# Altium schematic sheet [08] - Microcontroller.SchDoc
size A3
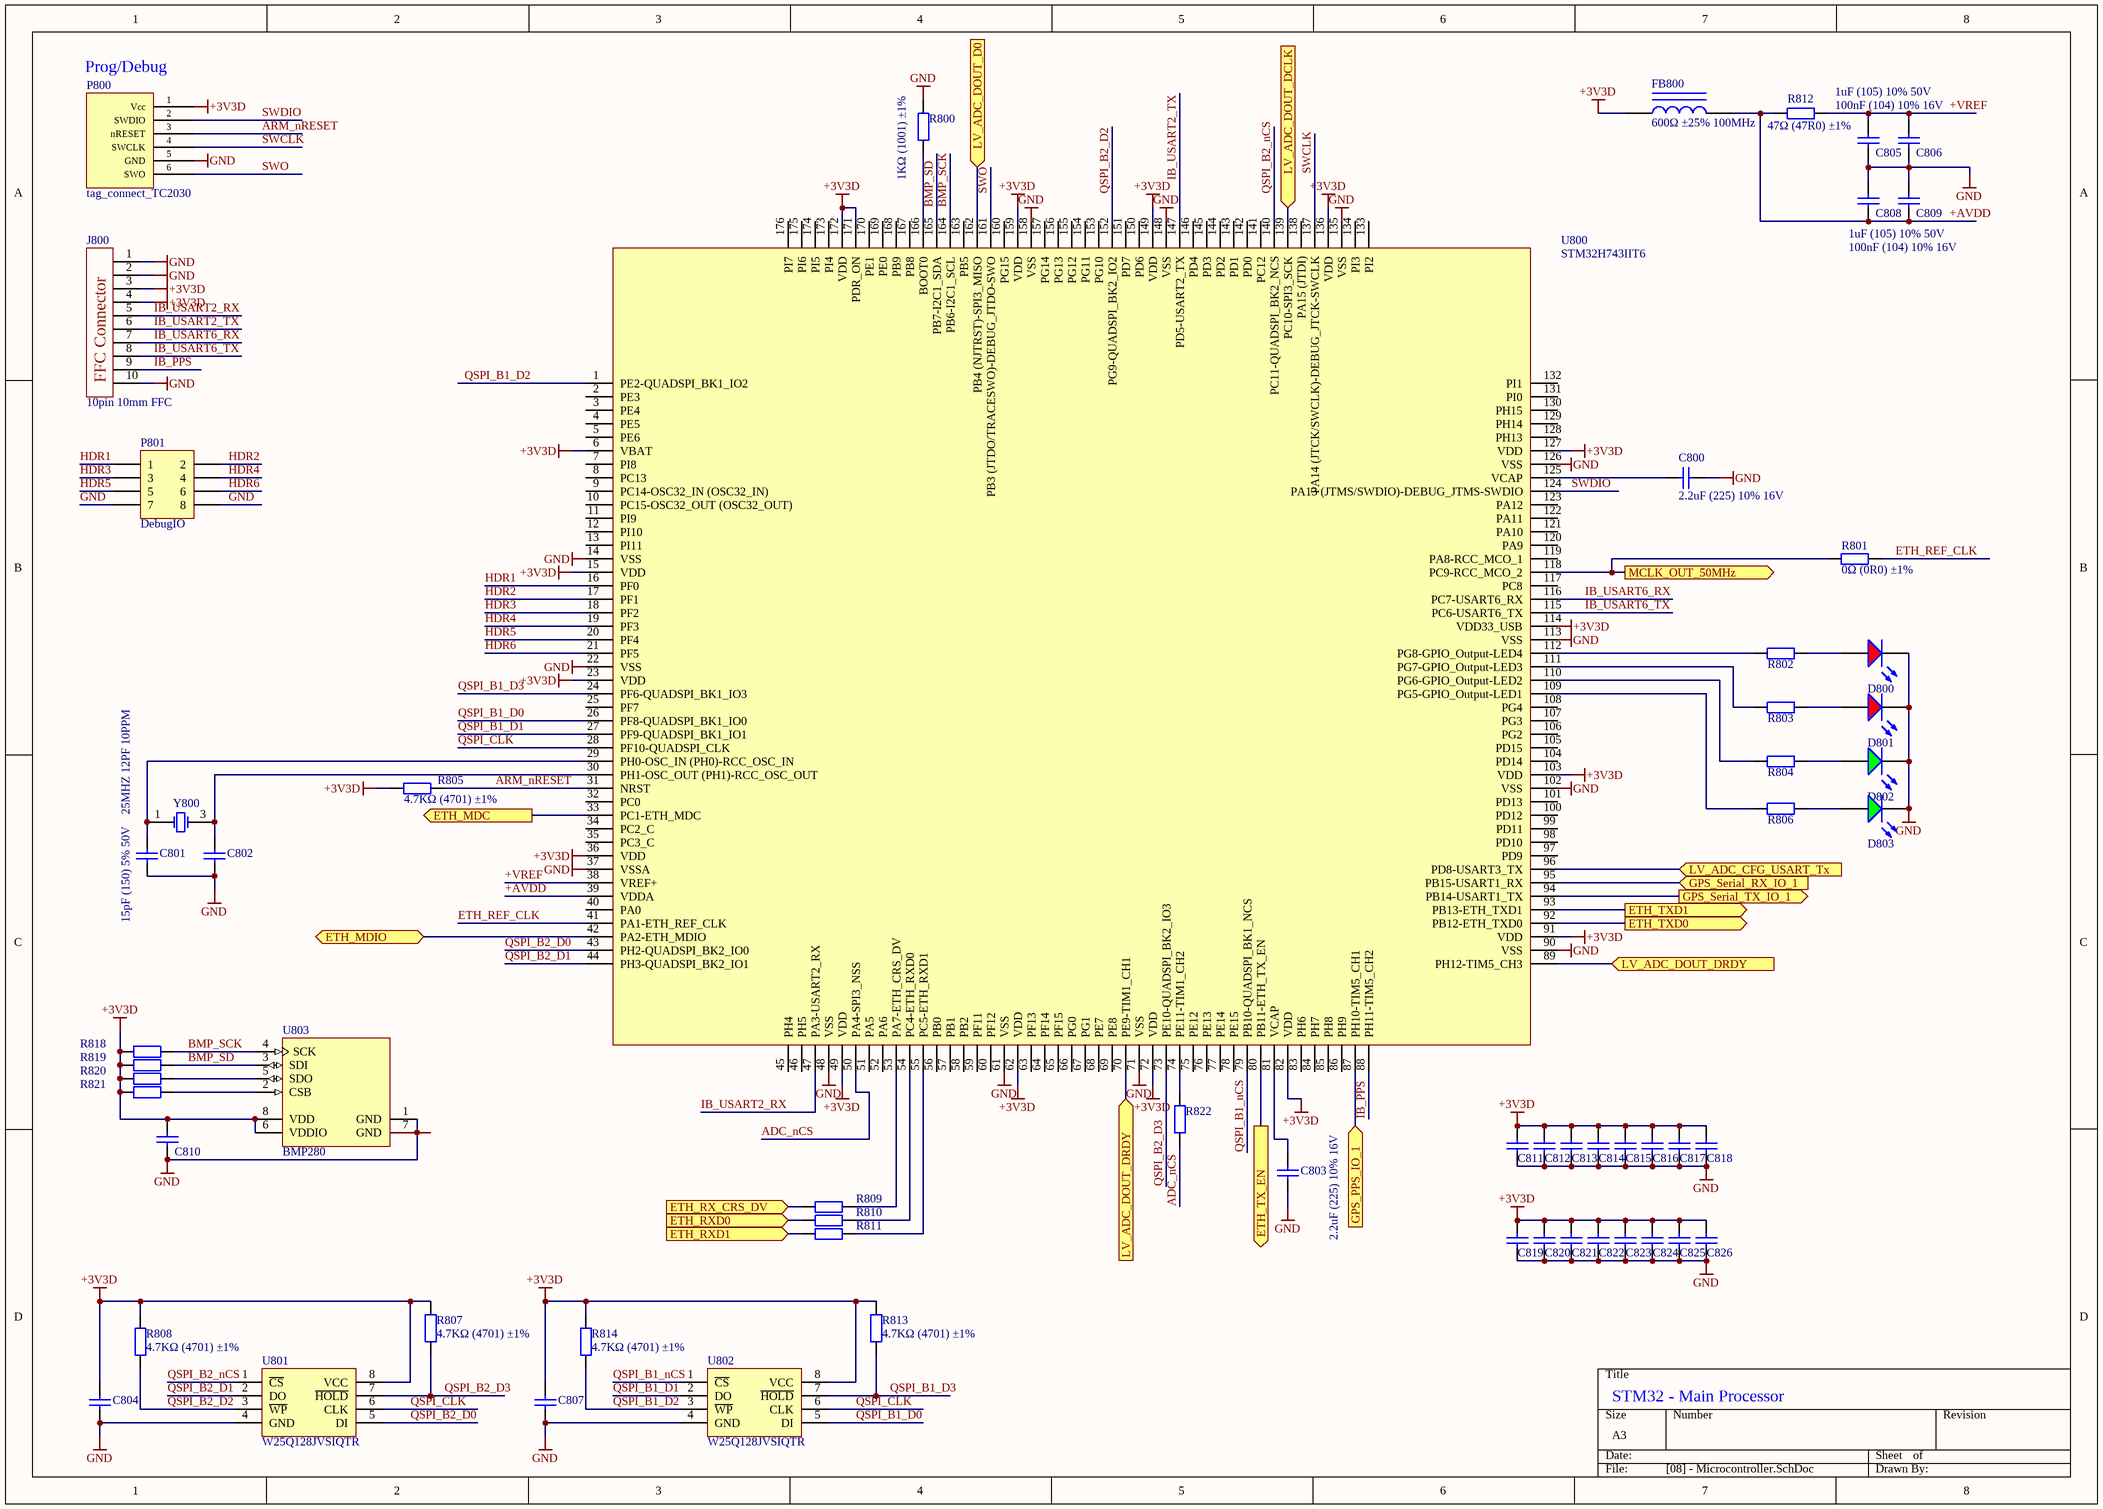
[diagram p0: [08] - Microcontroller.SchDoc]

## Parts
C800  2.2uF (225) 10% 16V  [0603_C]
C801  15pF (150) 5% 50V  [0402_C]
C802  15pF (150) 5% 50V  [0402_C]  (value not drawn)
C803  2.2uF (225) 10% 16V  [0603_C]
C804  100nF (104) 10% 16V  [0402_C]  (value not drawn)
C805  1uF (105) 10% 50V  [0603_C]
C806  100nF (104) 10% 16V  [0402_C]
C807  100nF (104) 10% 16V  [0402_C]  (value not drawn)
C808  1uF (105) 10% 50V  [0603_C]
C809  100nF (104) 10% 16V  [0402_C]
C810  100nF (104) 10% 16V  [0402_C]  (value not drawn)
C811  100nF (104) 10% 16V  [0402_C]  (value not drawn)
C812  100nF (104) 10% 16V  [0402_C]  (value not drawn)
C813  100nF (104) 10% 16V  [0402_C]  (value not drawn)
C814  100nF (104) 10% 16V  [0402_C]  (value not drawn)
C815  100nF (104) 10% 16V  [0402_C]  (value not drawn)
C816  100nF (104) 10% 16V  [0402_C]  (value not drawn)
C817  100nF (104) 10% 16V  [0402_C]  (value not drawn)
C818  100nF (104) 10% 16V  [0402_C]  (value not drawn)
C819  100nF (104) 10% 16V  [0402_C]  (value not drawn)
C820  100nF (104) 10% 16V  [0402_C]  (value not drawn)
C821  100nF (104) 10% 16V  [0402_C]  (value not drawn)
C822  100nF (104) 10% 16V  [0402_C]  (value not drawn)
C823  100nF (104) 10% 16V  [0402_C]  (value not drawn)
C824  100nF (104) 10% 16V  [0402_C]  (value not drawn)
C825  100nF (104) 10% 16V  [0402_C]  (value not drawn)
C826  100nF (104) 10% 16V  [0402_C]  (value not drawn)
D800  红灯 0603  [0603_LED_S1]  (value not drawn)
D801  红灯 0603  [0603_LED_S1]  (value not drawn)
D802  绿灯 0603  [0603_LED_S1]  (value not drawn)
D803  绿灯 0603  [0603_LED_S1]  (value not drawn)
FB800  600Ω ±25% 100MHz  [0805_L]
J800  10pin 10mm FFC  [AFA07-S10FCC-00]
P800  tag_connect_TC2030  [TC2030-MCP-NL]
P801  DebugIO  [HDR2X4]
R800  1KΩ (1001) ±1%  [0402_R]
R801  0Ω (0R0) ±1%  [0402_R]
R802  150Ω (1500) ±1%  [0402_R]  (value not drawn)
R803  150Ω (1500) ±1%  [0402_R]  (value not drawn)
R804  150Ω (1500) ±1%  [0402_R]  (value not drawn)
R805  4.7KΩ (4701) ±1%  [0402_R]
R806  150Ω (1500) ±1%  [0402_R]  (value not drawn)
R807  4.7KΩ (4701) ±1%  [0402_R]
R808  4.7KΩ (4701) ±1%  [0402_R]
R809  49.9Ω (49R9) ±1%  [0402_R]  (value not drawn)
R810  49.9Ω (49R9) ±1%  [0402_R]  (value not drawn)
R811  49.9Ω (49R9) ±1%  [0402_R]  (value not drawn)
R812  47Ω (47R0) ±1%  [0402_R]
R813  4.7KΩ (4701) ±1%  [0402_R]
R814  4.7KΩ (4701) ±1%  [0402_R]
R818  4.7KΩ (4701) ±1%  [0402_R]  (value not drawn)
R819  4.7KΩ (4701) ±1%  [0402_R]  (value not drawn)
R820  4.7KΩ (4701) ±1%  [0402_R]  (value not drawn)
R821  4.7KΩ (4701) ±1%  [0402_R]  (value not drawn)
R822  0Ω (0R0) ±1%  [0402_R]  (value not drawn)
U800  STM32H743IIT6  [Quad176]
U801  W25Q128JVSIQTR  [SOIC-8_208mil]
U802  W25Q128JVSIQTR  [SOIC-8_208mil]
U803  BMP280  [BOSC-LGA-8_V_LARGE]
Y800  25MHZ 12PF 10PPM  [SMD-3225_4P]

## Ports
ETH_MDC (out), ETH_MDIO (bidir), ETH_RX_CRS_DV (in), ETH_RXD0 (in), ETH_RXD1 (in), ETH_TX_EN (out), ETH_TXD0 (out), ETH_TXD1 (out), GPS_PPS_IO_1 (in), GPS_Serial_RX_IO_1 (in), GPS_Serial_TX_IO_1 (out), LV_ADC_CFG_USART_Tx (in), LV_ADC_DOUT_D0 (in), LV_ADC_DOUT_DCLK (in), LV_ADC_DOUT_DRDY (in), MCLK_OUT_50MHz (out)

## Nets
+3V3D: C804.2 C807.2 C810.2 C811.2 C812.2 C813.2 C814.2 C815.2 C816.2 C817.2 C818.2 C819.2 C820.2 C821.2 C822.2 C823.2 C824.2 C825.2 C826.2 FB800.1 J800.3 J800.4 P800.1(Vcc) R805.2 R807.2 R808.1 R813.2 R814.1 R818.1 R819.1 R820.1 R821.1 U800.6(VBAT) U800.15(VDD) U800.23(VDD) U800.36(VDD) U800.49(VDD) U800.62(VDD) U800.72(VDD) U800.82(VDD) U800.91(VDD) U800.103(VDD) U800.114(VDD33_USB) U800.127(VDD) U800.136(VDD) U800.149(VDD) U800.159(VDD) U800.171(PDR_ON) U800.172(VDD) U801.8(VCC) U802.8(VCC) U803.6(VDDIO) U803.8(VDD)
GND: C800.2 C801.1 C802.1 C803.2 C804.1 C805.1 C806.1 C807.1 C808.2 C809.2 C810.1 C811.1 C812.1 C813.1 C814.1 C815.1 C816.1 C817.1 C818.1 C819.1 C820.1 C821.1 C822.1 C823.1 C824.1 C825.1 C826.1 D800.K D801.K D802.K D803.K J800.1 J800.2 J800.10 P800.5(GND) P801.7 P801.8 R800.2 U800.14(VSS) U800.22(VSS) U800.37(VSSA) U800.48(VSS) U800.61(VSS) U800.71(VSS) U800.90(VSS) U800.102(VSS) U800.113(VSS) U800.126(VSS) U800.135(VSS) U800.148(VSS) U800.158(VSS) U801.4(GND) U802.4(GND) U803.1(GND) U803.7(GND)
+AVDD: C808.1 C809.1 FB800.2 R812.1 U800.39(VDDA)
+VREF: C805.2 C806.2 R812.2 U800.38(VREF+)
ADC_nCS: R822.1 U800.50(PA4-SPI3_NSS)
ARM_nRESET: P800.3(nRESET) R805.1 U800.31(NRST)
BMP_SCK: R818.2 U800.164(PB6-I2C1_SCL) U803.4(SCK)
BMP_SD: R819.2 U800.165(PB7-I2C1_SDA) U803.3(SDI)
ETH_MDC: U800.33(PC1-ETH_MDC) ; port ETH_MDC
ETH_MDIO: U800.42(PA2-ETH_MDIO) ; port ETH_MDIO
ETH_REF_CLK: R801.2 U800.41(PA1-ETH_REF_CLK)
ETH_RX_CRS_DV: R809.1 ; port ETH_RX_CRS_DV
ETH_RXD0: R810.1 ; port ETH_RXD0
ETH_RXD1: R811.1 ; port ETH_RXD1
ETH_TX_EN: U800.80(PB11-ETH_TX_EN) ; port ETH_TX_EN
ETH_TXD0: U800.92(PB12-ETH_TXD0) ; port ETH_TXD0
ETH_TXD1: U800.93(PB13-ETH_TXD1) ; port ETH_TXD1
GPS_PPS_IO_1: U800.87(PH10-TIM5_CH1) ; port GPS_PPS_IO_1
GPS_Serial_RX_IO_1: U800.95(PB15-USART1_RX) ; port GPS_Serial_RX_IO_1
GPS_Serial_TX_IO_1: U800.94(PB14-USART1_TX) ; port GPS_Serial_TX_IO_1
HDR1: P801.1 U800.16(PF0)
HDR2: P801.2 U800.17(PF1)
HDR3: P801.3 U800.18(PF2)
HDR4: P801.4 U800.19(PF3)
HDR5: P801.5 U800.20(PF4)
HDR6: P801.6 U800.21(PF5)
IB_PPS: J800.9 U800.88(PH11-TIM5_CH2)
IB_USART2_RX: J800.5 U800.47(PA3-USART2_RX)
IB_USART2_TX: J800.6 U800.147(PD5-USART2_TX)
IB_USART6_RX: J800.7 U800.116(PC7-USART6_RX)
IB_USART6_TX: J800.8 U800.115(PC6-USART6_TX)
LV_ADC_CFG_USART_Tx: U800.96(PD8-USART3_TX) ; port LV_ADC_CFG_USART_Tx
LV_ADC_DOUT_D0: U800.162(PB4_(NJTRST)-SPI3_MISO) ; port LV_ADC_DOUT_D0
LV_ADC_DOUT_DCLK: U800.139(PC10-SPI3_SCK) ; port LV_ADC_DOUT_DCLK
LV_ADC_DOUT_DRDY: U800.70(PE9-TIM1_CH1) U800.89(PH12-TIM5_CH3) ; port LV_ADC_DOUT_DRDY
MCLK_OUT_50MHz: R801.1 U800.118(PC9-RCC_MCO_2) ; port MCLK_OUT_50MHz
QSPI_B1_D0: U800.26(PF8-QUADSPI_BK1_IO0) U802.5(DI)
QSPI_B1_D1: U800.27(PF9-QUADSPI_BK1_IO1) U802.2(DO)
QSPI_B1_D2: R814.2 U800.1(PE2-QUADSPI_BK1_IO2) U802.3(~{WP})
QSPI_B1_D3: R813.1 U800.24(PF6-QUADSPI_BK1_IO3) U802.7(~{HOLD})
QSPI_B1_nCS: U800.79(PB10-QUADSPI_BK1_NCS) U802.1(~{CS})
QSPI_B2_D0: U800.43(PH2-QUADSPI_BK2_IO0) U801.5(DI)
QSPI_B2_D1: U800.44(PH3-QUADSPI_BK2_IO1) U801.2(DO)
QSPI_B2_D2: R808.2 U800.152(PG9-QUADSPI_BK2_IO2) U801.3(~{WP})
QSPI_B2_D3: R807.1 U800.73(PE10-QUADSPI_BK2_IO3) U801.7(~{HOLD})
QSPI_B2_nCS: U800.140(PC11-QUADSPI_BK2_NCS) U801.1(~{CS})
QSPI_CLK: U800.28(PF10-QUADSPI_CLK) U801.6(CLK) U802.6(CLK)
SWCLK: P800.4(SWCLK) U800.137(PA14_(JTCK/SWCLK)-DEBUG_JTCK-SWCLK)
SWDIO: P800.2(SWDIO) U800.124(PA13_(JTMS/SWDIO)-DEBUG_JTMS-SWDIO)
SWO: P800.6(SWO) U800.161(PB3_(JTDO/TRACESWO)-DEBUG_JTDO-SWO)
NetC800_1: C800.1 U800.125(VCAP)
NetC801_2: C801.2 U800.29(PH0-OSC_IN_(PH0)-RCC_OSC_IN) Y800.1(OSC1)
NetC802_2: C802.2 U800.30(PH1-OSC_OUT_(PH1)-RCC_OSC_OUT) Y800.3(OSC2)
NetC803_1: C803.1 U800.81(VCAP)
NetD800_A: D800.A R802.1
NetD801_A: D801.A R803.1
NetD802_A: D802.A R804.1
NetD803_A: D803.A R806.1
NetR800_1: R800.1 U800.166(BOOT0)
NetR802_2: R802.2 U800.112(PG8-GPIO_Output-LED4)
NetR803_2: R803.2 U800.111(PG7-GPIO_Output-LED3)
NetR804_2: R804.2 U800.110(PG6-GPIO_Output-LED2)
NetR806_2: R806.2 U800.109(PG5-GPIO_Output-LED1)
NetR809_2: R809.2 U800.53(PA7-ETH_CRS_DV)
NetR810_2: R810.2 U800.54(PC4-ETH_RXD0)
NetR811_2: R811.2 U800.55(PC5-ETH_RXD1)
NetR820_2: R820.2 U803.5(SDO)
NetR821_2: R821.2 U803.2(CSB)
NetR822_2: R822.2 U800.74(PE11-TIM1_CH2)

Not connected (* = marked no-connect by the designer): U800 2(PE3) 3(PE4) 4(PE5) 5(PE6) 7(PI8) 8(PC13) 9(PC14-OSC32_IN_(OSC32_IN)) 10(PC15-OSC32_OUT_(OSC32_OUT)) 11(PI9) 12(PI10) 13(PI11) 25(PF7) 32(PC0) 34(PC2_C) 35(PC3_C) 40(PA0) 45(PH4) 46(PH5) 51(PA5) 52(PA6) 56(PB0) 57(PB1) 58(PB2) 59(PF11) 60(PF12) 63(PF13) 64(PF14) 65(PF15) 66(PG0) 67(PG1) 68(PE7) 69(PE8) 75(PE12) 76(PE13) 77(PE14) 78(PE15) 83(PH6) 84(PH7) 85(PH8) 86(PH9) 97(PD9) 98(PD10) 99(PD11) 100(PD12) 101(PD13) 104(PD14) 105(PD15) 106(PG2) 107(PG3) 108(PG4) 117(PC8) 119(PA8-RCC_MCO_1) 120(PA9) 121(PA10) 122(PA11) 123(PA12) 128(PH13) 129(PH14) 130(PH15) 131(PI0) 132(PI1) 133(PI2) 134(PI3) 138(PA15_(JTDI)) 141(PC12) 142(PD0) 143(PD1) 144(PD2) 145(PD3) 146(PD4) 150(PD6) 151(PD7) 153(PG10) 154(PG11) 155(PG12) 156(PG13) 157(PG14) 160(PG15) 163(PB5) 167(PB8) 168(PB9) 169(PE0) 170(PE1) 173(PI4) 174(PI5) 175(PI6) 176(PI7)

## Notes on the sheet
- (near P800) Prog/Debug
- STM32 - Main Processor
- (in symbol AFA07-S10FCC-00) FFC Connector

## Library data of the parts
C800 C803 = 0603 2.2uF (225) 10% 16V: 贴片电容; ComponentLink1Description: 供应商链接; ComponentLink1URL: http://www.szlcsc.com/product/details_24366.html; Package: 0603; Supplier: LC; SuppliersPartNumber: C23630
C801 C802 = 0402 15pF (150) 5% 50V: 贴片电容; ComponentLink1Description: 供应商链接; ComponentLink1URL: http://www.szlcsc.com/product/details_1900.html; Package: 0402; Supplier: LC; SuppliersPartNumber: C1548
C804 C806 C807 C809-C826 = 0402 100nF (104) 10% 16V: 贴片电容; ComponentLink1Description: 供应商链接; ComponentLink1URL: http://www.szlcsc.com/product/details_1877.html; Package: 0402; Supplier: LC; SuppliersPartNumber: C1525
C805 C808 = 0603 1uF (105) 10% 50V: 贴片电容; ComponentLink1Description: 供应商链接; ComponentLink1URL: http://www.szlcsc.com/product/details_16531.html; Package: 0603; Supplier: LC; SuppliersPartNumber: C15849
D800 D801 = 0603 红灯: 发光二极管; ComponentLink1Description: 供应商链接; ComponentLink1URL: http://www.szlcsc.com/product/details_2659.html; Package: 0603; Supplier: LC; SuppliersPartNumber: C2286
D802 D803 = 0603 绿灯: 发光二极管; ComponentLink1Description: 供应商链接; ComponentLink1URL: http://www.szlcsc.com/product/details_73152.html; Package: 0603; Supplier: LC; SuppliersPartNumber: C72043
FB800 = 0805 600Ω 25% 100MHz: 贴片磁珠; ComponentLink1Description: 供应商链接; ComponentLink1URL: http://www.szlcsc.com/product/details_1369.html; Package: 0805; Supplier: LC; SuppliersPartNumber: C1017
J800 = AFA07-S10FCC-00: FPC Contact,Bottom 10 0.039"（1.00mm） 1.0mm FFC, FPC Connectors RoHS; SuppliersPartNumber: C52162; JLCPCB: NO
P801 = Header 4X2: Header, 4-Pin, Dual row; LatestRevisionDate: 17-Jul-2002; LatestRevisionNote: Re-released for DXP Platform.; Publisher: Altium Limited; JLCPCB: NO
R800 = 0402 1KΩ (1001) 1%: 贴片电阻; ComponentLink1Description: 供应商链接; ComponentLink1URL: http://www.szlcsc.com/product/details_12256.html; Package: 0402; Supplier: LC; SuppliersPartNumber: C11702
R801 R822 = 0402 0Ω (0R0) 1%: 贴片电阻; ComponentLink1Description: 供应商链接; ComponentLink1URL: http://www.szlcsc.com/product/details_17853.html; Package: 0402; Supplier: LC; SuppliersPartNumber: C17168
R802-R804 R806 = 0402 150Ω (1500) 1%: 贴片电阻; ComponentLink1Description: 供应商链接; ComponentLink1URL: http://www.szlcsc.com/product/details_25825.html; Package: 0402; Supplier: LC; SuppliersPartNumber: C25082
R805 R807 R808 R813 R814 R818-R821 = 0402 4.7KΩ (4701) 1%: 贴片电阻; ComponentLink1Description: 供应商链接; ComponentLink1URL: http://www.szlcsc.com/product/details_26643.html; Package: 0402; Supplier: LC; SuppliersPartNumber: C25900
R809-R811 = 0402 49.9Ω (49R9) 1%: 贴片电阻; ComponentLink1Description: 供应商链接; ComponentLink1URL: http://www.szlcsc.com/product/details_25863.html; Package: 0402; Supplier: LC; SuppliersPartNumber: C25120
R812 = 0402 47Ω (47R0) 1%: 贴片电阻; ComponentLink1Description: 供应商链接; ComponentLink1URL: http://www.szlcsc.com/product/details_25861.html; Package: 0402; Supplier: LC; SuppliersPartNumber: C25118
U800 = STM32H743IIT6: ST MICROELECTRONICS LQFP-176_24X24X05P ROHS; SuppliersPartNumber: C89597
U801 U802 = W25Q128JVSIQTR_[C97521]: Flash ROM; ComponentLink1Description: 供应商链接; ComponentLink1URL: https://item.szlcsc.com/98729.html; Package: SOIC-8; Supplier: LC; SuppliersPartNumber: C97521
U803 = BOSC-BMP280-LGA-8: Digital Pressure Sensor, 1.71 to 3.6 V, -40 to 85 degC, 8-Pin LGA, RoHS, Tape and Reel; Manufacturer: Bosch Sensortec; Manufacturer URL: http://www.bosch-sensortec.com; Datasheet URL: http://datasheet.octopart.com/BMP280-Bosch-datasheet-41546027.pdf; Datasheet Version: Rev. 1.14, 05/2015; SuppliersPartNumber: C83291
Y800 = SMD-3225_4P  25MHZ 12PF 10PPM: 贴片晶振; ComponentLink1Description: 供应商链接; ComponentLink1URL: http://www.szlcsc.com/product/details_9526.html; Package: SMD-3225_4P; Supplier: LC; SuppliersPartNumber: C9006
P800 = tag_connect_TC2030: JLCPCB: NO